# Altium schematic sheet Architecture.SchDoc: BLOCK DIAGRAM
size 420 x 297 mm; SheetNumber: 1
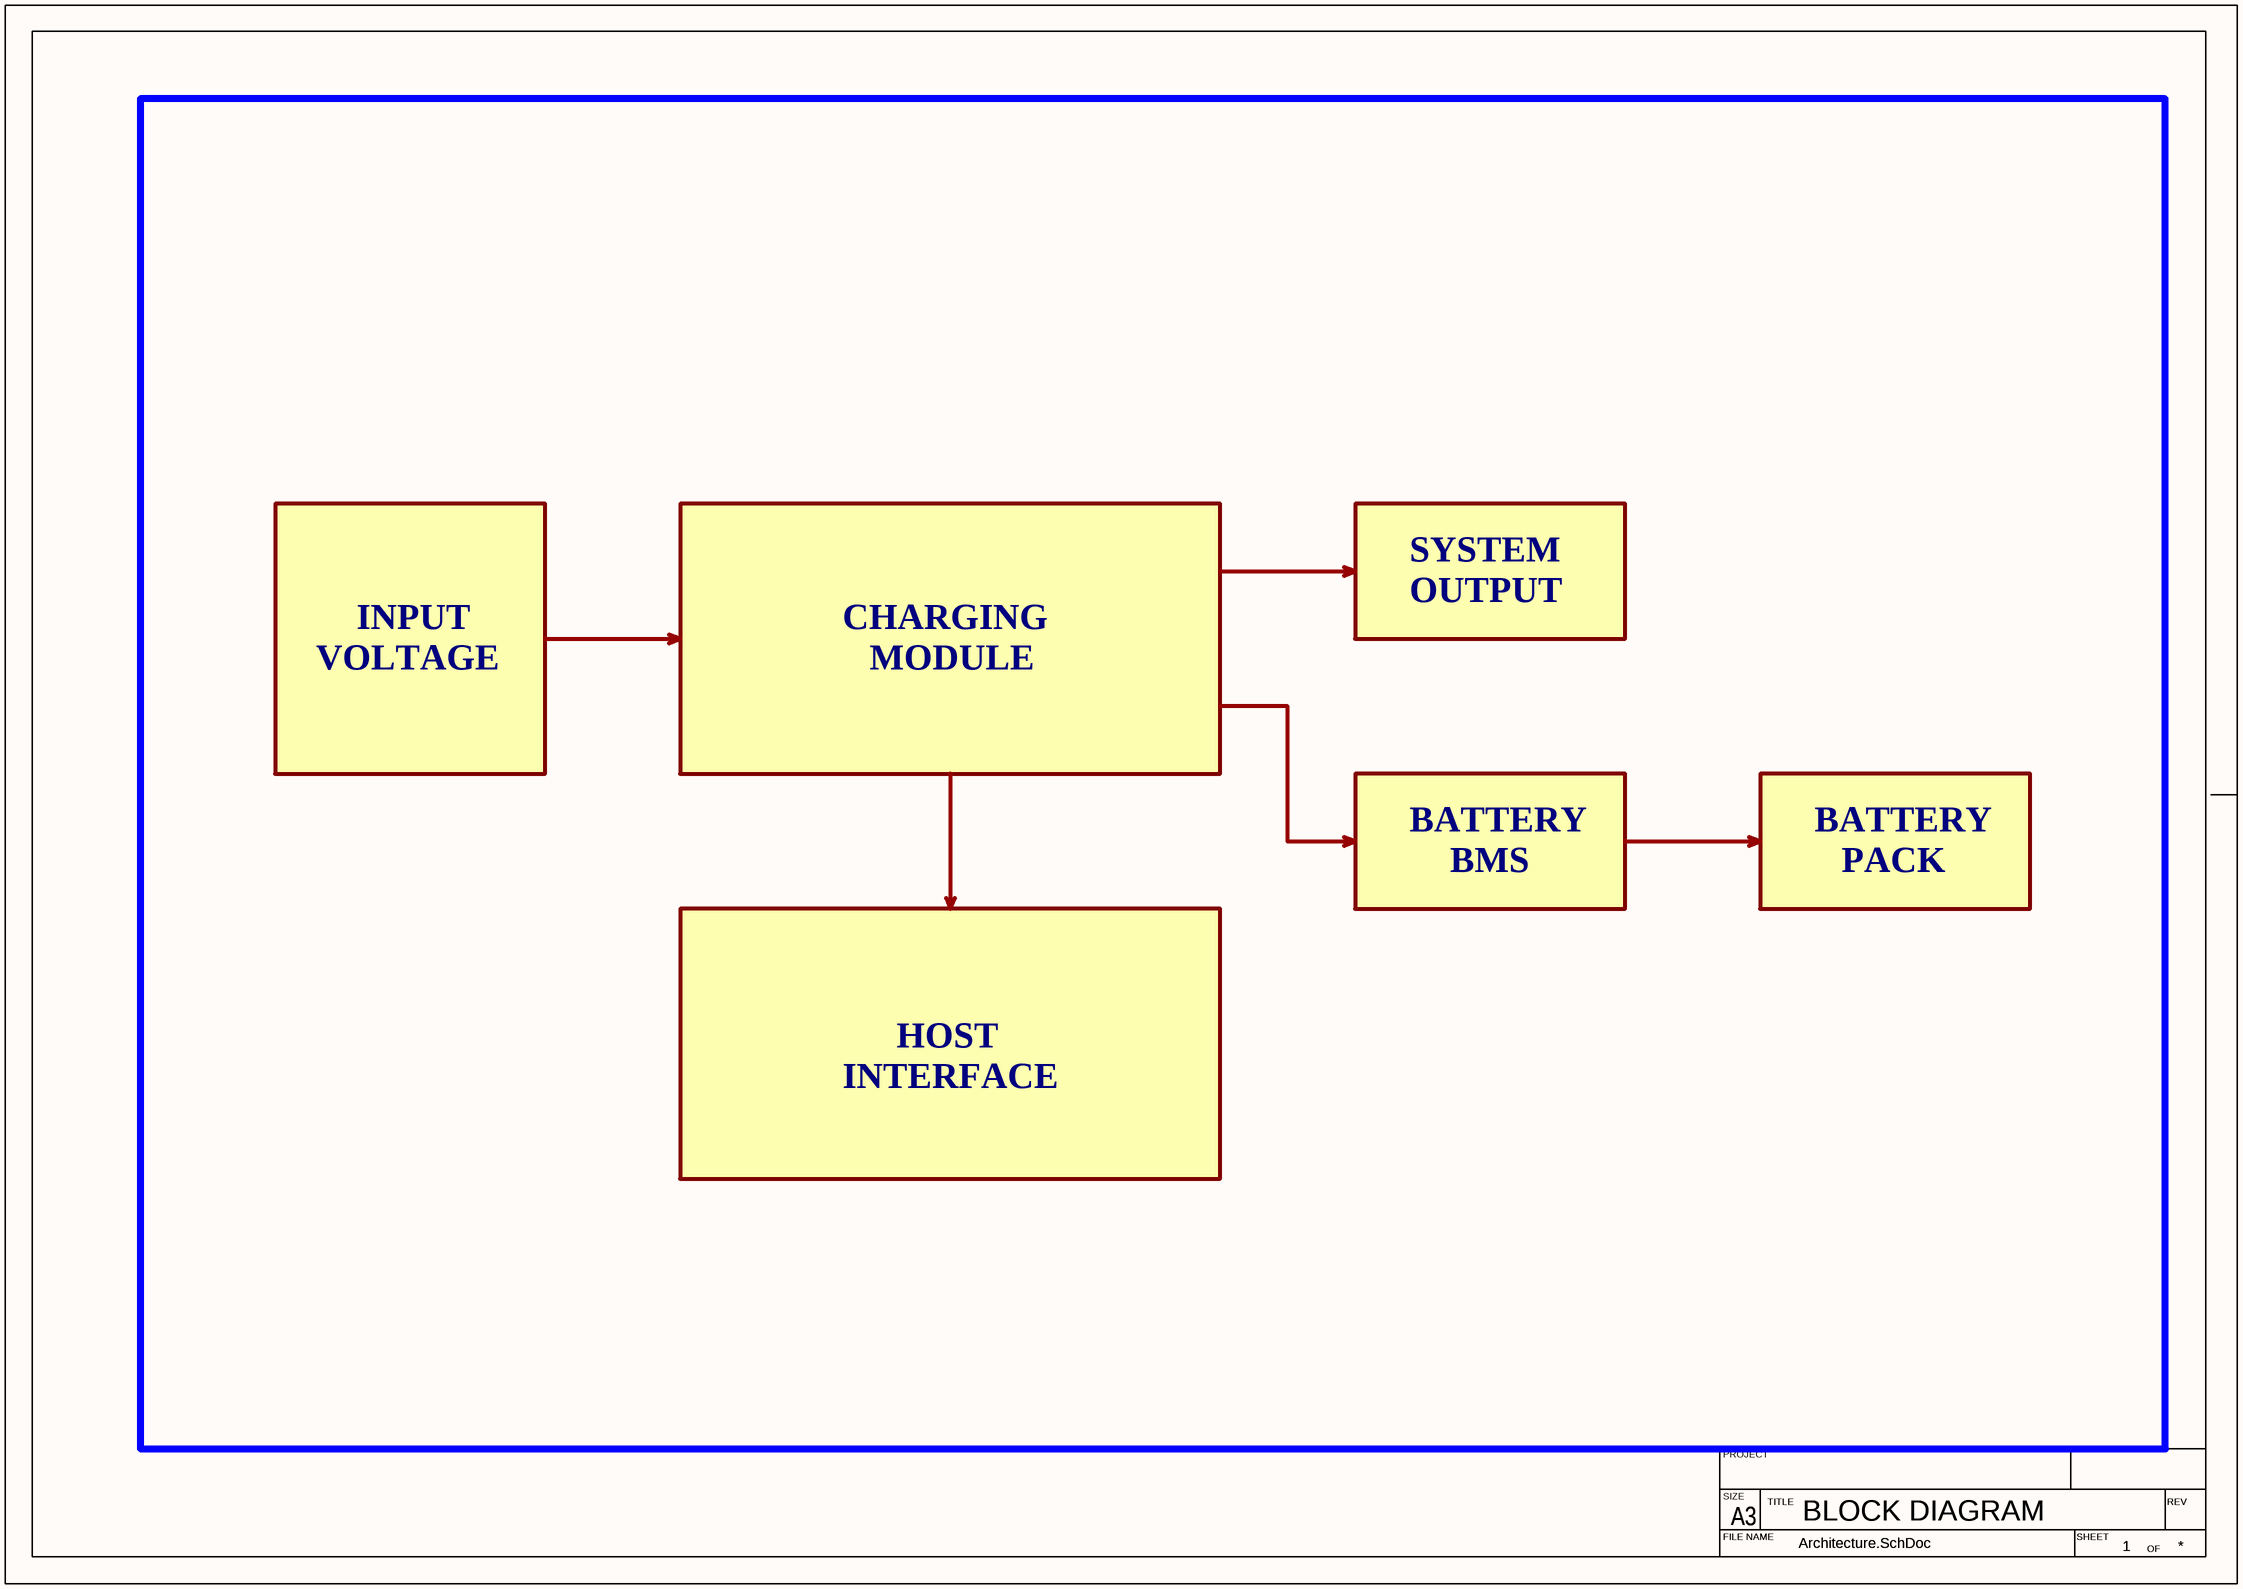
[diagram p0: Architecture.SchDoc]

## Notes on the sheet
- SYSTEM
- INPUT
- CHARGING
- OUTPUT
- VOLTAGE
- MODULE
- BATTERY
- BMS
- PACK
- HOST
- INTERFACE
- PROJECT
- SIZE
- FILE NAME
- A3
- TITLE
- SHEET
- OF
- REV